# EAGLE schematic Schm1 (EAGLE 6.6.0)

## Sheet 1 of 3
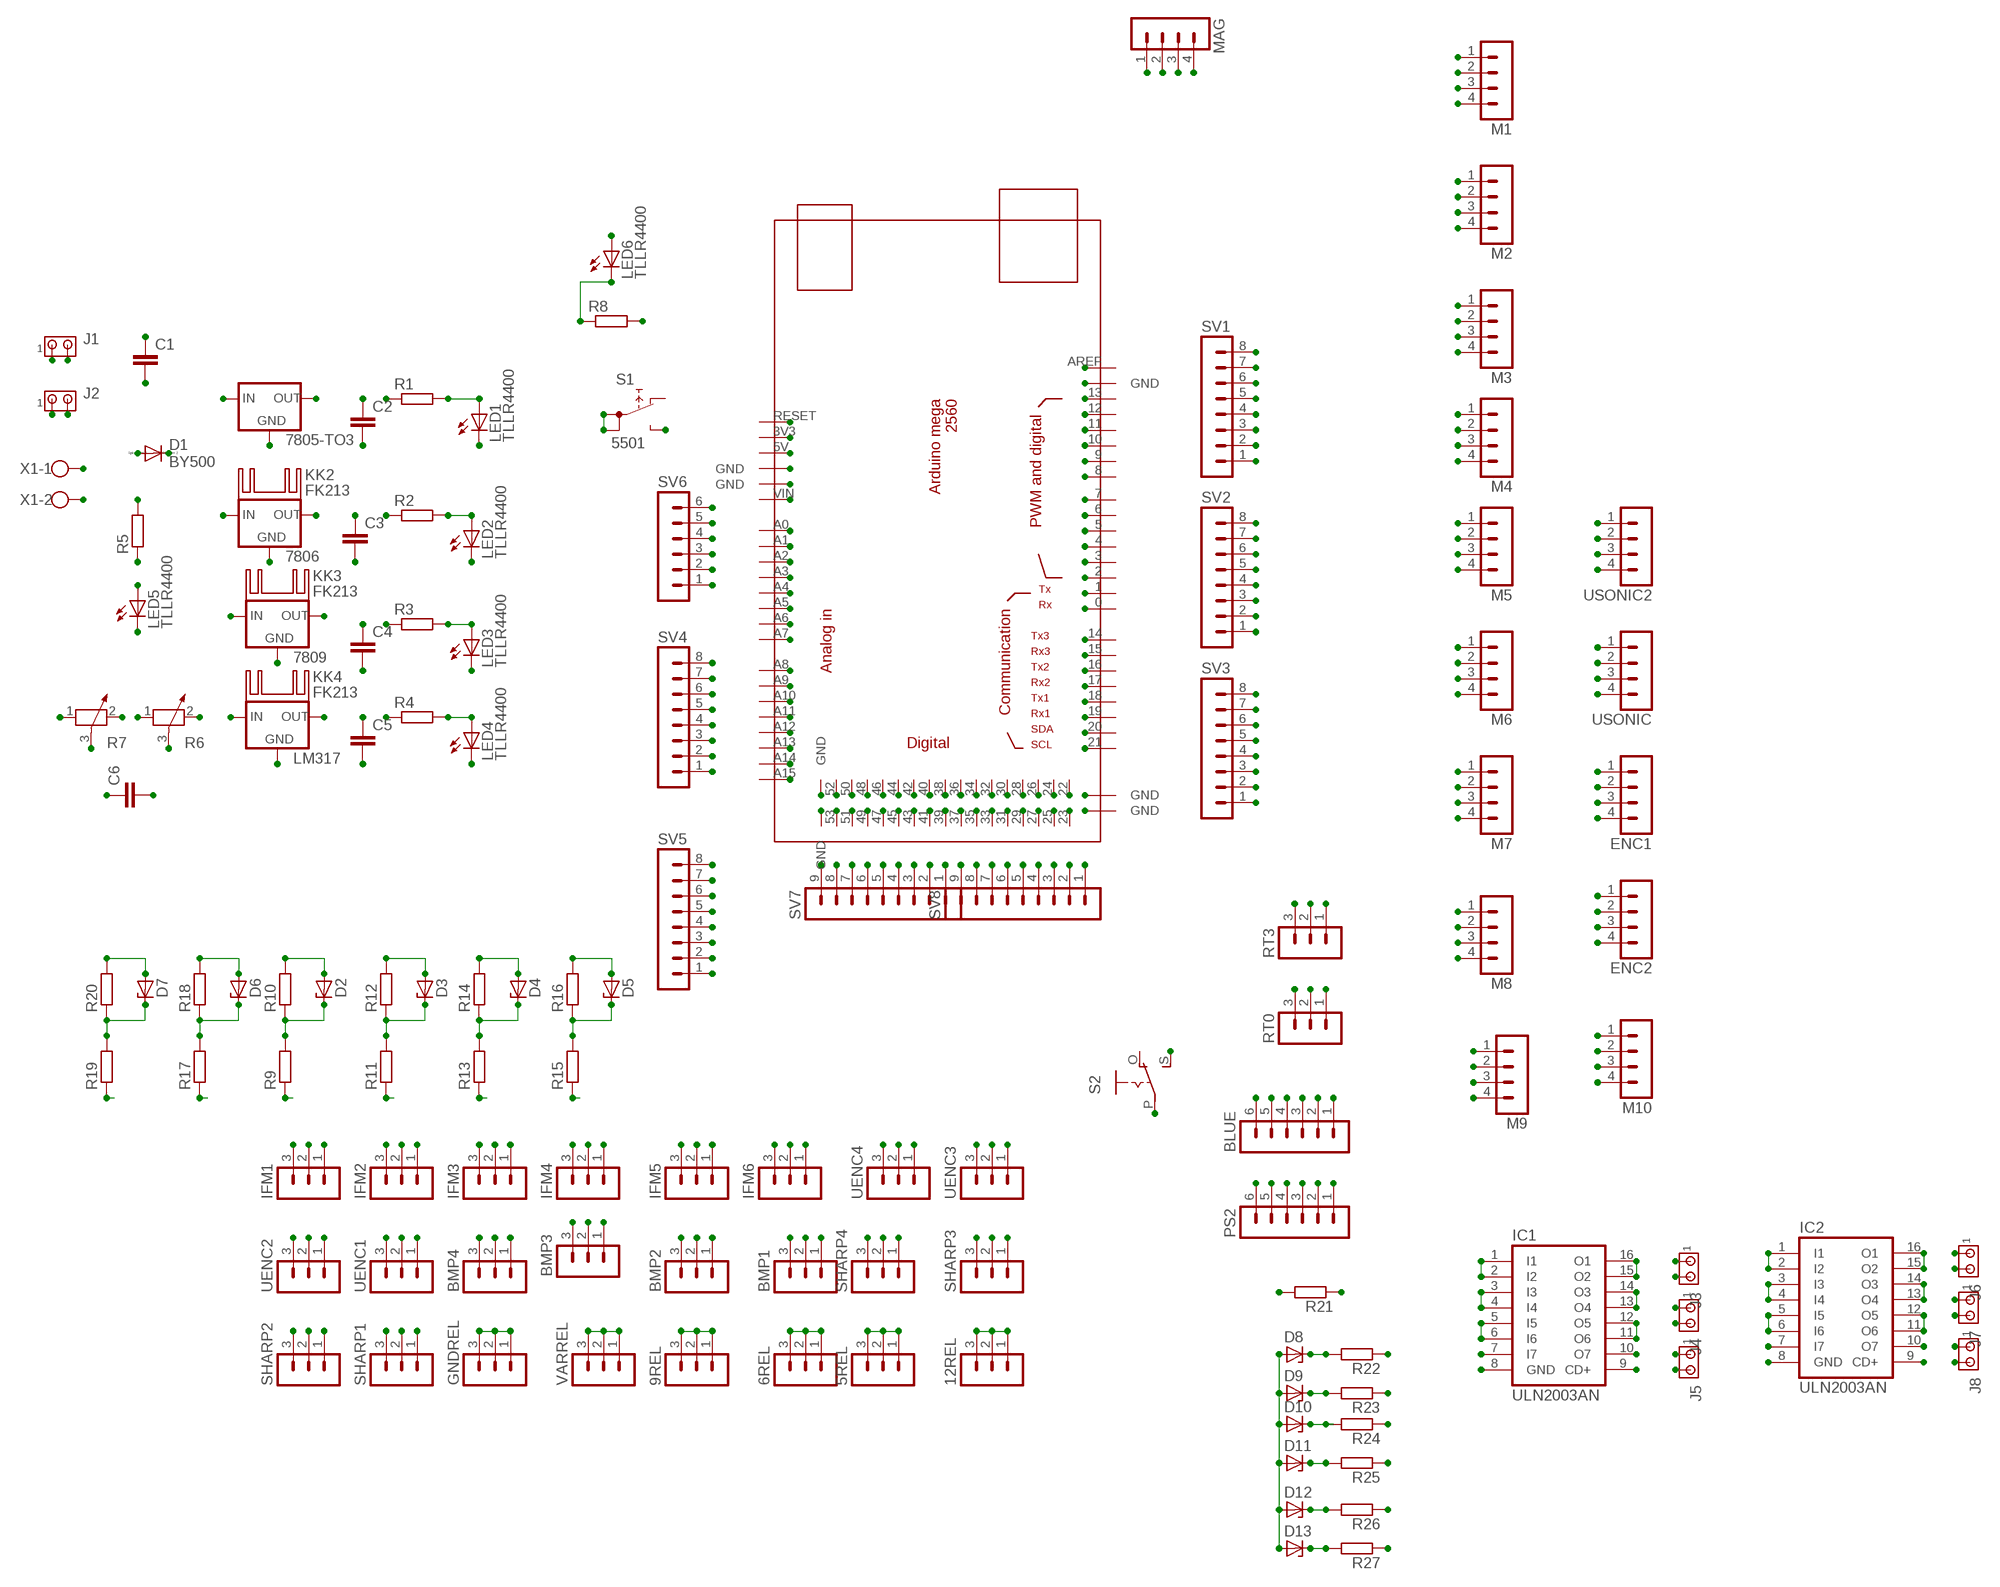
[diagram p0: schematic, sheet 1]

### Parts
5REL  MA03-1  [MA03-1]
6REL  MA03-1  [MA03-1]
9REL  MA03-1  [MA03-1]
12REL  MA03-1  [MA03-1]
7805-TO3  78XX-TO3  [TO3-78]
7806  78XXS  [78XXS]
7809  78XXS  [78XXS]
BLUE  MA06-1  [MA06-1]
BMP1  MA03-1  [MA03-1]
BMP2  MA03-1  [MA03-1]
BMP3  MA03-1  [MA03-1]
BMP4  MA03-1  [MA03-1]
C1  C-EU075-063X106  [C075-063X106]
C2  C-EU050-075X075  [C050-075X075]
C3  C-EU050-075X075  [C050-075X075]
C4  C-EU050-075X075  [C050-075X075]
C5  C-EU050-075X075  [C050-075X075]
C6  C-EU050-075X075  [C050-075X075]
D1  BY500  [DO201-15]
D2  ZENER-DIODEDO34-7  [DO34Z7]
D3  ZENER-DIODEDO34-7  [DO34Z7]
D4  ZENER-DIODEDO34-7  [DO34Z7]
D5  ZENER-DIODEDO34-7  [DO34Z7]
D6  ZENER-DIODEDO34-7  [DO34Z7]
D7  ZENER-DIODEDO34-7  [DO34Z7]
D8  ZENER-DIODEDO34-7  [DO34Z7]
D9  ZENER-DIODEDO34-7  [DO34Z7]
D10  ZENER-DIODEDO34-7  [DO34Z7]
D11  ZENER-DIODEDO34-7  [DO34Z7]
D12  ZENER-DIODEDO34-7  [DO34Z7]
D13  ZENER-DIODEDO34-7  [DO34Z7]
ENC1  MA04-1  [MA04-1]
ENC2  MA04-1  [MA04-1]
GNDREL  MA03-1  [MA03-1]
IC1  ULN2003AN  [DIL16]
IC2  ULN2003AN  [DIL16]
IFM1  MA03-1  [MA03-1]
IFM2  MA03-1  [MA03-1]
IFM3  MA03-1  [MA03-1]
IFM4  MA03-1  [MA03-1]
IFM5  MA03-1  [MA03-1]
IFM6  MA03-1  [MA03-1]
J1  MTA02-156  [1X2MTA]
J2  MTA02-156  [1X2MTA]
J3  MTA02-100  [10X02MTA]
J4  MTA02-100  [10X02MTA]
J5  MTA02-100  [10X02MTA]
J6  MTA02-100  [10X02MTA]
J7  MTA02-100  [10X02MTA]
J8  MTA02-100  [10X02MTA]
KK2  FK213  [FK213]
KK3  FK213  [FK213]
KK4  FK213  [FK213]
LED1  TLLR4400  [LED3MM]
LED2  TLLR4400  [LED3MM]
LED3  TLLR4400  [LED3MM]
LED4  TLLR4400  [LED3MM]
LED5  TLLR4400  [LED3MM]
LED6  TLLR4400  [LED3MM]
LM317  78XXS  [78XXS]
M1  MA04-1  [MA04-1]
M2  MA04-1  [MA04-1]
M3  MA04-1  [MA04-1]
M4  MA04-1  [MA04-1]
M5  MA04-1  [MA04-1]
M6  MA04-1  [MA04-1]
M7  MA04-1  [MA04-1]
M8  MA04-1  [MA04-1]
M9  MA04-1  [MA04-1]
M10  MA04-1  [MA04-1]
MAG  MA04-1  [MA04-1]
PS2  MA06-1  [MA06-1]
R1  R-EU_0207/10  [0207/10]
R2  R-EU_0207/10  [0207/10]
R3  R-EU_0207/10  [0207/10]
R4  R-EU_0207/10  [0207/10]
R5  R-EU_0207/10  [0207/10]
R6  POTENTIOMETER_PT-10  [PT-10]
R7  POTENTIOMETER_PT-10  [PT-10]
R8  R-EU_0207/10  [0207/10]
R9  R-EU_0207/10  [0207/10]
R10  R-EU_0207/10  [0207/10]
R11  R-EU_0207/10  [0207/10]
R12  R-EU_0207/10  [0207/10]
R13  R-EU_0207/10  [0207/10]
R14  R-EU_0207/10  [0207/10]
R15  R-EU_0207/10  [0207/10]
R16  R-EU_0207/10  [0207/10]
R17  R-EU_0207/10  [0207/10]
R18  R-EU_0207/10  [0207/10]
R19  R-EU_0207/10  [0207/10]
R20  R-EU_0207/10  [0207/10]
R21  R-EU_0207/10  [0207/10]
R22  R-EU_0207/10  [0207/10]
R23  R-EU_0207/10  [0207/10]
R24  R-EU_0207/10  [0207/10]
R25  R-EU_0207/10  [0207/10]
R26  R-EU_0207/10  [0207/10]
R27  R-EU_0207/10  [0207/10]
RT0  MA03-1  [MA03-1]
RT3  MA03-1  [MA03-1]
S1  5501  [5501]
S2  EG1218S  [EG1218]
SHARP1  MA03-1  [MA03-1]
SHARP2  MA03-1  [MA03-1]
SHARP3  MA03-1  [MA03-1]
SHARP4  MA03-1  [MA03-1]
SV1  MA08-1  [MA08-1]
SV2  MA08-1  [MA08-1]
SV3  MA08-1  [MA08-1]
SV4  MA08-1  [MA08-1]
SV5  MA08-1  [MA08-1]
SV6  MA06-1  [MA06-1]
SV7  MA09-1  [MA09-1]
SV8  MA09-1  [MA09-1]
U$1  MEGA_DEVICE  [MEGABOX]
UENC1  MA03-1  [MA03-1]
UENC2  MA03-1  [MA03-1]
UENC3  MA03-1  [MA03-1]
UENC4  MA03-1  [MA03-1]
USONIC  MA04-1  [MA04-1]
USONIC2  MA04-1  [MA04-1]
VARREL  MA03-1  [MA03-1]
X1  W237-102  [W237-102]

### Nets
0: RT0.2 SV2.1 U$1.0
1: RT0.3 SV2.2 U$1.1
2: ENC1.1 SV2.3 U$1.2 UENC1.3
3: ENC1.2 SV2.4 U$1.3 UENC2.3
3V3: MAG.2 SV6.5 U$1.3V3
4: M1.1 SV2.5 U$1.4
5: M6.1 SV2.6 U$1.5
5OUT: 5REL.1 5REL.2 5REL.3 7805-TO3.1(OUT) BLUE.3 BMP1.2 BMP2.2 BMP3.2 BMP4.2 C2.1 ENC1.3 ENC2.3 PS2.2 R1.1 R21.1 SHARP1.1 SHARP2.1 SHARP3.1 SHARP4.1 UENC1.2 UENC2.2 UENC3.2 UENC4.2 USONIC2.4 USONIC.4
6: M7.1 SV2.7 U$1.6
6OUT: 6REL.1 6REL.2 6REL.3 7806.OUT C3.1 R2.1
7: M8.1 SV2.8 U$1.7
8: M9.1 SV1.1 U$1.8
9: M10.1 SV1.2 U$1.9
10: M5.1 SV1.3 U$1.10
11: M4.1 SV1.4 U$1.11
12: M3.1 SV1.5 U$1.12
12IN: 7805-TO3.2(IN) 7806.IN 7809.IN C6.1 D1.C LM317.IN
12V: 12REL.1 12REL.2 12REL.3 C1.1 D1.A IC1.9(CD+) IC2.9(CD+) IFM1.2 IFM2.2 IFM3.2 IFM4.2 IFM5.2 IFM6.2 J1.1 J2.1 J3.1 J4.1 J5.1 J6.1 J7.1 J8.1 R5.2 X1.1
13: M2.1 SV1.6 U$1.13
14: RT3.3 SV3.8 U$1.14
15: RT3.2 SV3.7 U$1.15
16: BLUE.5 SV3.6 U$1.16
17: BLUE.4 SV3.5 U$1.17
18: ENC2.1 SV3.4 U$1.18 UENC3.3
19: ENC2.2 SV3.3 U$1.19 UENC4.3
20: MAG.3 SV3.2 U$1.20
21: MAG.4 SV3.1 U$1.21
22: M1.2 U$1.22
23: M1.3 SV8.2 U$1.23
24: M2.2 U$1.24
25: M6.2 SV8.3 U$1.25
26: M2.3 U$1.26
27: M6.3 SV8.4 U$1.27
28: M3.2 U$1.28
29: M7.2 SV8.5 U$1.29
30: M3.3 U$1.30
31: M7.3 SV8.6 U$1.31
32: M4.2 U$1.32
33: M8.2 SV8.7 U$1.33
34: M4.3 U$1.34
35: M8.3 SV8.8 U$1.35
36: M5.2 U$1.36
37: M9.2 SV8.9 U$1.37
38: M5.3 U$1.38
39: M9.3 SV7.1 U$1.39
40: BMP4.3 U$1.40
41: D11.C R25.2 SV7.2 U$1.41
42: BMP2.3 U$1.42
43: D12.C R26.2 SV7.3 U$1.43
44: BMP1.3 U$1.44
45: D13.C R27.2 SV7.4 U$1.45
46: BMP3.3 U$1.46
47: PS2.6 SV7.5 U$1.47
48: D10.C R24.2 U$1.48
49: PS2.5 SV7.6 U$1.49
50: D9.C R23.2 U$1.50
51: PS2.4 SV7.7 U$1.51
52: D8.C R22.2 U$1.52
53: PS2.3 R21.2 SV7.8 U$1.53
A0: M10.3 SV4.8 U$1.A0
A1: M10.2 SV4.7 U$1.A1
A2: SHARP1.3 SV4.6 U$1.A2
A3: SHARP2.3 SV4.5 U$1.A3
A4: SHARP3.3 SV4.4 U$1.A4
A5: SHARP4.3 SV4.3 U$1.A5
A6: SV4.2 U$1.A6 USONIC.3
A7: SV4.1 U$1.A7 USONIC.2
A8: SV5.8 U$1.A8 USONIC2.3
A9: SV5.7 U$1.A9 USONIC2.2
A10: D7.C R19.2 R20.1 SV5.6 U$1.A10
A11: D6.C R17.2 R18.1 SV5.5 U$1.A11
A12: D2.C R9.2 R10.1 SV5.4 U$1.A12
A13: D3.C R11.2 R12.1 SV5.3 U$1.A13
A14: D4.C R13.2 R14.1 SV5.2 U$1.A14
A15: D5.C R15.2 R16.1 SV5.1 U$1.A15
AREF: SV1.8 U$1.AREF
B3V3: BLUE.2 S2.P
DIN: LED5.A R5.1
GND: 7805-TO3.3(GND) 7806.GND 7809.GND BLUE.1 BMP1.1 BMP2.1 BMP3.1 BMP4.1 C1.2 C2.2 C3.2 C4.2 C5.2 C6.2 D2.A D3.A D4.A D5.A D6.A D7.A D8.A D9.A D10.A D11.A D12.A D13.A ENC1.4 ENC2.4 GNDREL.1 GNDREL.2 GNDREL.3 IC1.8(GND) IC2.8(GND) IFM1.1 IFM2.1 IFM3.1 IFM4.1 IFM5.1 IFM6.1 J1.2 J2.2 LED1.K(C) LED2.K(C) LED3.K(C) LED4.K(C) LED5.K(C) M1.4 M2.4 M3.4 M4.4 M5.4 M6.4 M7.4 M8.4 M9.4 M10.4 MAG.1 PS2.1 R7.3 R8.2 R10.2 R12.2 R14.2 R16.2 R18.2 R20.2 RT0.1 RT3.1 S1.NO SHARP1.2 SHARP2.2 SHARP3.2 SHARP4.2 SV1.7 SV6.2 SV6.3 SV7.9 U$1.GND@1(GND) U$1.GND@2(GND) U$1.GND@3(GND) U$1.GND@6(GND) U$1.GND@7(GND) UENC1.1 UENC2.1 UENC3.1 UENC4.1 USONIC2.1 USONIC.1 X1.2
JOK1: LM317.GND R6.3 R7.1
KEY: BLUE.6 S2.S
N$3: R7.2
N$4: LED6.K(C) R8.1
N$7: R6.2
N$10: IC1.7(I7)
N$13: LED4.A R4.2
N$16: LED3.A R3.2
N$17: LED2.A R2.2
N$20: LED1.A R1.2
N$22: IC1.10(O7)
N$25: IC2.7(I7)
N$38: IC2.10(O7)
PN1: IC1.15(O2) IC1.16(O1) J3.2
PN2: IC1.13(O4) IC1.14(O3) J4.2
PN3: IC1.11(O6) IC1.12(O5) J5.2
PN4: IC2.15(O2) IC2.16(O1) J6.2
PN5: IC2.13(O4) IC2.14(O3) J7.2
PN6: IC2.11(O6) IC2.12(O5) J8.2
RESET: S1.1A S1.1B SV6.6 U$1.RESET
S1: IFM1.3 R19.1
S2: IFM2.3 R17.1
S3: IFM3.3 R9.1
S4: IFM4.3 R11.1
S5: IFM5.3 R13.1
S6: IFM6.3 R15.1
U1: IC1.5(I5) IC1.6(I6) R22.1
U2: IC1.3(I3) IC1.4(I4) R23.1
U3: IC1.1(I1) IC1.2(I2) R24.1
U4: IC2.5(I5) IC2.6(I6) R25.1
U5: IC2.3(I3) IC2.4(I4) R26.1
U6: IC2.1(I1) IC2.2(I2) R27.1
VAROUT: C5.1 LM317.OUT R4.1 R6.1 VARREL.1 VARREL.2 VARREL.3
VCC: LED6.A SV6.4 SV8.1 U$1.5V U$1.GND@4(GND) U$1.GND@5(GND)
VIN: 9REL.1 9REL.2 9REL.3 7809.OUT C4.1 R3.1 SV6.1 U$1.VIN
Unconnected: S1.NC S2.O

## Sheet 2 of 3
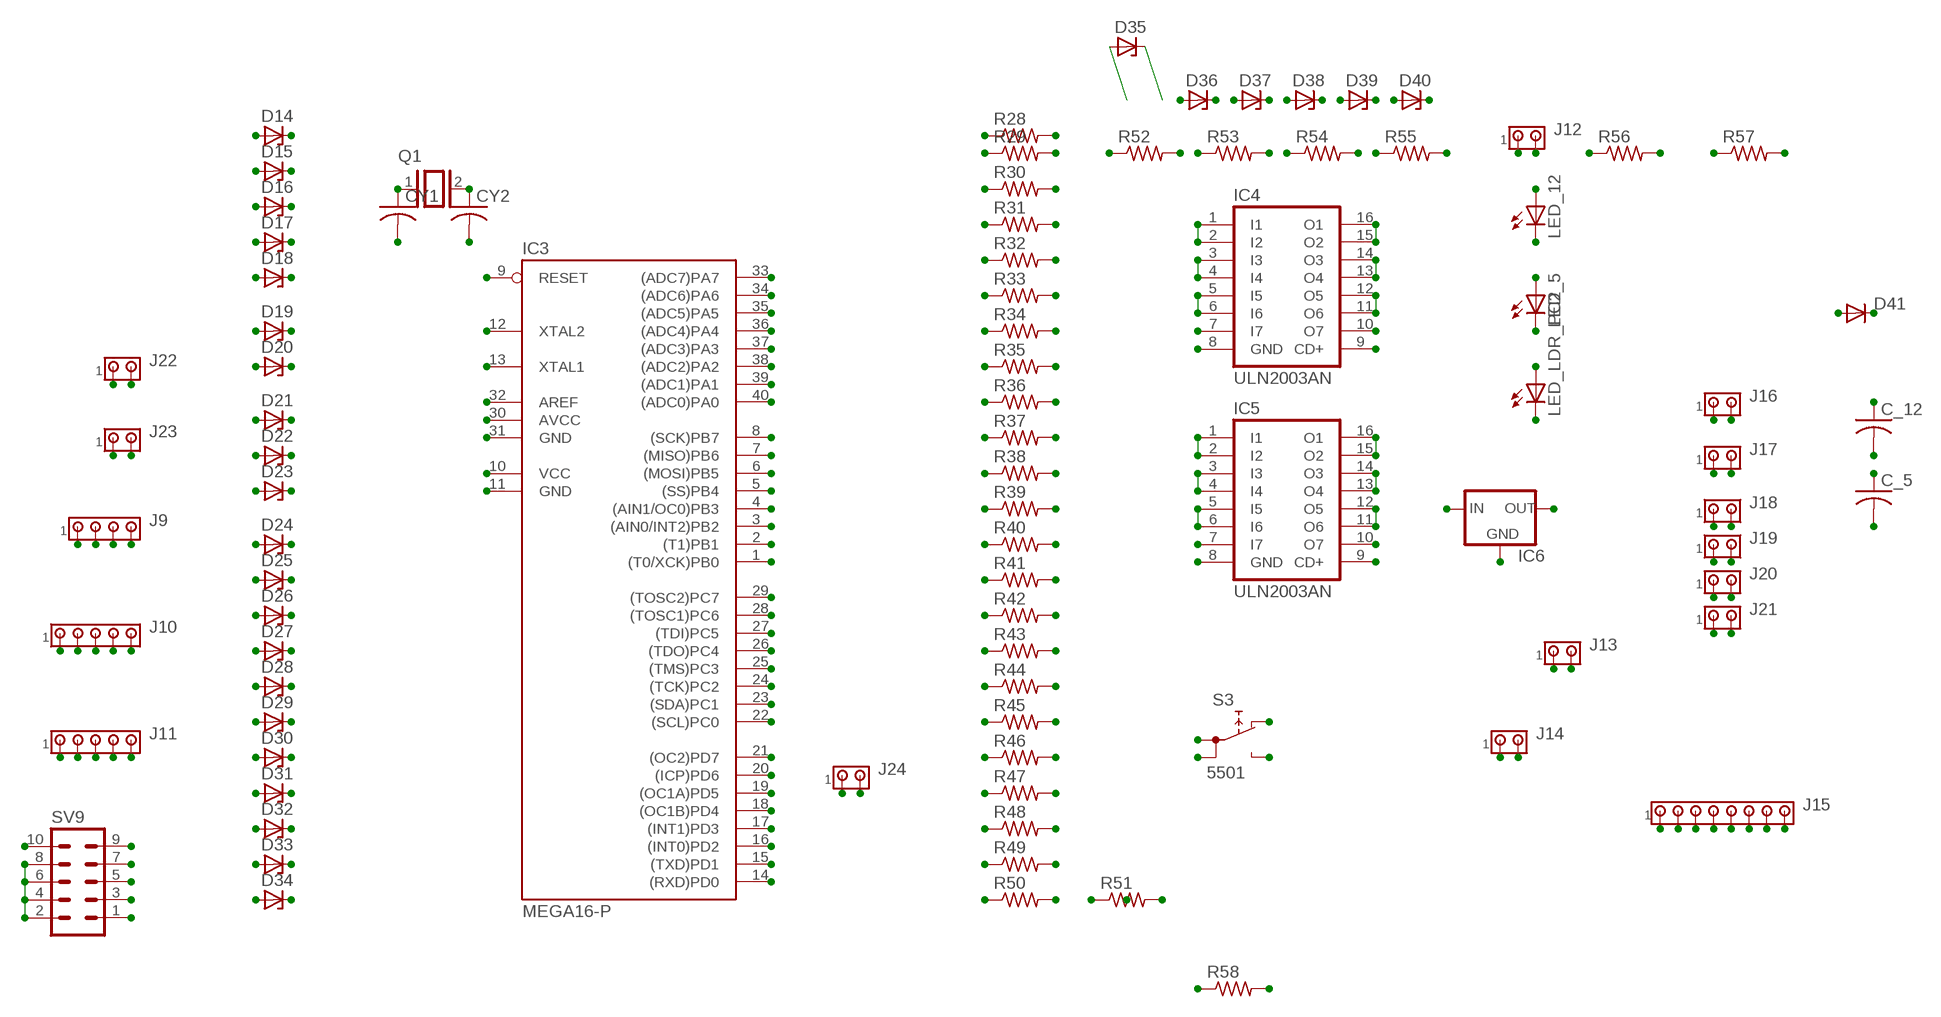
[diagram p1: schematic, sheet 2]

### Parts
C_5  C-US050-075X075  [C050-075X075]
C_12  C-US050-075X075  [C050-075X075]
CY1  C-US050-024X044  [C050-024X044]
CY2  C-US050-024X044  [C050-024X044]
D14  ZENER-DIODEDO34-7  [DO34Z7]
D15  ZENER-DIODEDO34-7  [DO34Z7]
D16  ZENER-DIODEDO34-7  [DO34Z7]
D17  ZENER-DIODEDO34-7  [DO34Z7]
D18  ZENER-DIODEDO34-7  [DO34Z7]
D19  ZENER-DIODEDO34-7  [DO34Z7]
D20  ZENER-DIODEDO34-7  [DO34Z7]
D21  ZENER-DIODEDO34-7  [DO34Z7]
D22  ZENER-DIODEDO34-7  [DO34Z7]
D23  ZENER-DIODEDO34-7  [DO34Z7]
D24  ZENER-DIODEDO34-7  [DO34Z7]
D25  ZENER-DIODEDO34-7  [DO34Z7]
D26  ZENER-DIODEDO34-7  [DO34Z7]
D27  ZENER-DIODEDO34-7  [DO34Z7]
D28  ZENER-DIODEDO34-7  [DO34Z7]
D29  ZENER-DIODEDO34-7  [DO34Z7]
D30  ZENER-DIODEDO34-7  [DO34Z7]
D31  ZENER-DIODEDO34-7  [DO34Z7]
D32  ZENER-DIODEDO34-7  [DO34Z7]
D33  ZENER-DIODEDO34-7  [DO34Z7]
D34  ZENER-DIODEDO34-7  [DO34Z7]
D35  ZENER-DIODEDO34-7  [DO34Z7]
D36  ZENER-DIODEDO34-7  [DO34Z7]
D37  ZENER-DIODEDO34-7  [DO34Z7]
D38  ZENER-DIODEDO34-7  [DO34Z7]
D39  ZENER-DIODEDO34-7  [DO34Z7]
D40  ZENER-DIODEDO34-7  [DO34Z7]
D41  DIODE-DO201-15  [DO201-15]
IC3  MEGA16-P  [DIL40]
IC4  ULN2003AN  [DIL16]
IC5  ULN2003AN  [DIL16]
IC6  78XX-TO3  [TO3-78]
J9  MTA04-100  [10X04MTA]
J10  MTA05-100  [10X05MTA]
J11  MTA05-100  [10X05MTA]
J12  MTA02-156  [1X2MTA]
J13  MTA02-156  [1X2MTA]
J14  MTA02-100  [10X02MTA]
J15  MTA08-100  [10X08MTA]
J16  MTA02-100  [10X02MTA]
J17  MTA02-100  [10X02MTA]
J18  MTA02-100  [10X02MTA]
J19  MTA02-100  [10X02MTA]
J20  MTA02-100  [10X02MTA]
J21  MTA02-100  [10X02MTA]
J22  MTA02-100  [10X02MTA]
J23  MTA02-156  [1X2MTA]
J24  MTA02-100  [10X02MTA]
LED_5  LED3MM  [LED3MM]
LED_12  LED3MM  [LED3MM]
LED_LDR_PC2  LED3MM  [LED3MM]
Q1  XTAL/S  [QS]
R28  R-US_0207/7  [0207/7]
R29  R-US_0207/7  [0207/7]
R30  R-US_0207/7  [0207/7]
R31  R-US_0207/7  [0207/7]
R32  R-US_0207/7  [0207/7]
R33  R-US_0207/7  [0207/7]
R34  R-US_0207/7  [0207/7]
R35  R-US_0207/7  [0207/7]
R36  R-US_0207/7  [0207/7]
R37  R-US_0207/7  [0207/7]
R38  R-US_0207/7  [0207/7]
R39  R-US_0207/7  [0207/7]
R40  R-US_0207/7  [0207/7]
R41  R-US_0207/7  [0207/7]
R42  R-US_0207/7  [0207/7]
R43  R-US_0207/7  [0207/7]
R44  R-US_0207/7  [0207/7]
R45  R-US_0207/7  [0207/7]
R46  R-US_0207/7  [0207/7]
R47  R-US_0207/7  [0207/7]
R48  R-US_0207/7  [0207/7]
R49  R-US_0207/7  [0207/7]
R50  R-US_0207/7  [0207/7]
R51  R-US_0207/7  [0207/7]
R52  R-US_0207/7  [0207/7]
R53  R-US_0207/7  [0207/7]
R54  R-US_0207/7  [0207/7]
R55  R-US_0207/7  [0207/7]
R56  R-US_0207/7  [0207/7]
R57  R-US_0207/7  [0207/7]
R58  R-US_0207/7  [0207/7]
S3  5501  [5501]
SV9  MA05-2  [MA05-2]

### Nets
12V1: C_12.1 D41.C IC4.9(CD+) IC5.9(CD+) IC6.2(IN) J12.1 J16.2 J17.2 J18.2 J19.2 J20.2 J21.2 J22.1 R28.2 R29.2 R30.2 R31.2 R32.2 R33.2 R34.2 R35.2 R36.2 R37.2 R38.2 R39.2 R40.2 R41.2 R42.2 R43.2 R44.2 R45.2 R46.2 R47.2 R48.2 R49.2
AREF1: IC3.32(AREF)
D: D41.A J23.1
GND1: C_5.2 C_12.2 CY1.2 CY2.2 D14.A D15.A D16.A D17.A D18.A D19.A D20.A D21.A D22.A D23.A D24.A D25.A D26.A D27.A D28.A D29.A D30.A D31.A D32.A D33.A D34.A D35.A D36.A D37.A D38.A D39.A D40.A IC3.11(GND) IC3.31(GND) IC4.8(GND) IC5.8(GND) IC6.3(GND) J9.4 J12.2 J13.2 J14.2 J22.2 J23.2 LED_5.K(C) LED_12.K(C) LED_LDR_PC2.K(C) S3.NO SV9.2 SV9.4 SV9.6 SV9.8
LED1: LED_12.A R49.1
LED2: LED_5.A R50.1
LED3: LED_LDR_PC2.A R51.2
N1: IC4.15(O2) IC4.16(O1) J16.1
N2: IC4.13(O4) IC4.14(O3) J17.1
N3: IC4.11(O6) IC4.12(O5) J18.1
N4: IC5.15(O2) IC5.16(O1) J19.1
N5: IC5.13(O4) IC5.14(O3) J20.1
N6: IC5.11(O6) IC5.12(O5) J21.1
N$29: SV9.7
N$30: S3.NC
N$162: IC4.7(I7)
N$170: IC4.10(O7)
N$178: IC5.10(O7)
N$186: IC5.7(I7)
PA0: D34.C IC3.40((ADC0)PA0) J15.1 R48.1
PA1: D33.C IC3.39((ADC1)PA1) J15.2 R47.1
PA2: D32.C IC3.38((ADC2)PA2) J15.3 R46.1
PA3: D31.C IC3.37((ADC3)PA3) J15.4 R45.1
PA4: D30.C IC3.36((ADC4)PA4) J15.5 R44.1
PA5: D29.C IC3.35((ADC5)PA5) J15.6 R43.1
PA6: D28.C IC3.34((ADC6)PA6) J15.7 R42.1
PA7: D27.C IC3.33((ADC7)PA7) J15.8 R41.1
PB0: D14.C IC3.1((T0/XCK)PB0) J10.1 R28.1
PB1: D15.C IC3.2((T1)PB1) J10.2 R29.1
PB2: D16.C IC3.3((AIN0/INT2)PB2) J10.3 R30.1
PB3: D17.C IC3.4((AIN1/OC0)PB3) J10.4 R31.1
PB4: D18.C IC3.5((SS)PB4) J10.5 R32.1
PB5: IC3.6((MOSI)PB5) SV9.9
PB6: IC3.7((MISO)PB6) SV9.1
PB7: IC3.8((SCK)PB7) SV9.3
PC0: D25.C IC3.22((SCL)PC0) J9.2 R39.1
PC1: D26.C IC3.23((SDA)PC1) J9.1 R40.1
PC2: D40.C IC3.24((TCK)PC2) R51.1 R57.1
PC3: D39.C IC3.25((TMS)PC3) R56.1
PC4: D38.C IC3.26((TDO)PC4) R55.1
PC5: D37.C IC3.27((TDI)PC5) R54.1
PC6: D36.C IC3.28((TOSC1)PC6) R53.1
PC7: D35.C IC3.29((TOSC2)PC7) R52.1
PD0: IC3.14((RXD)PD0) J24.1
PD1: IC3.15((TXD)PD1) J24.2
PD2: D19.C IC3.16((INT0)PD2) J11.1 R33.1
PD3: D20.C IC3.17((INT1)PD3) J11.2 R34.1
PD4: D21.C IC3.18((OC1B)PD4) J11.3 R35.1
PD5: D22.C IC3.19((OC1A)PD5) J11.4 R36.1
PD6: D23.C IC3.20((ICP)PD6) J11.5 R37.1
PD7: D24.C IC3.21((OC2)PD7) J9.3 R38.1
RESET1: IC3.9(RESET) R58.2 S3.1A S3.1B SV9.5
U7: IC4.1(I1) IC4.2(I2) R52.2
U8: IC4.3(I3) IC4.4(I4) R53.2
U9: IC4.5(I5) IC4.6(I6) R54.2
U10: IC5.1(I1) IC5.2(I2) R55.2
U11: IC5.3(I3) IC5.4(I4) R56.2
U12: IC5.5(I5) IC5.6(I6) R57.2
VCC1: C_5.1 IC3.10(VCC) IC3.30(AVCC) IC6.1(OUT) J13.1 J14.1 R50.2 R58.1 SV9.10
XTAL1: CY1.1 IC3.13(XTAL1) Q1.1
XTAL2: CY2.1 IC3.12(XTAL2) Q1.2

## Sheet 3 of 3
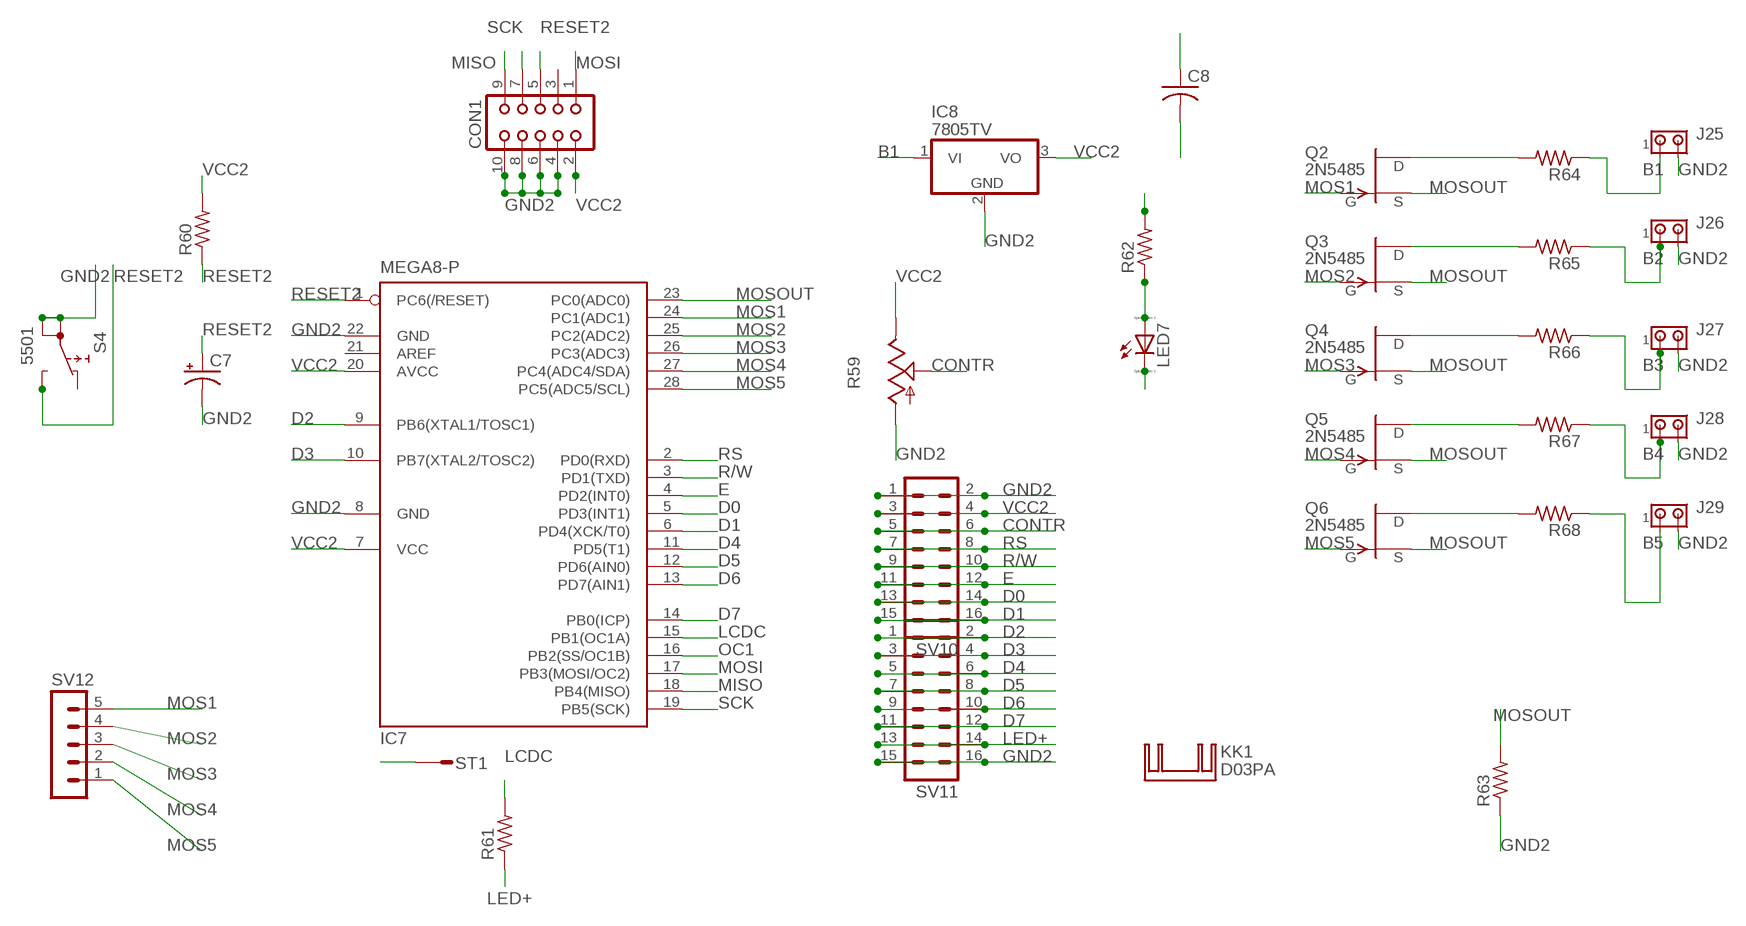
[diagram p2: schematic, sheet 3]

### Parts
C7  CPOL-USE2.5-7  [E2,5-7]
C8  C-US075-042X103  [C075-042X103]
CON1  CON10  [CON10]
IC7  MEGA8-P  [DIL28-3]
IC8  7805TV  [TO220V]
J25  MTA02-156  [1X2MTA]
J26  MTA02-156  [1X2MTA]
J27  MTA02-156  [1X2MTA]
J28  MTA02-156  [1X2MTA]
J29  MTA02-156  [1X2MTA]
KK1  D03PA  [D03PA]
LED7  LED_ELD260  [LED_LD260]
Q2  2N5485  [TO92-]
Q3  2N5485  [TO92-]
Q4  2N5485  [TO92-]
Q5  2N5485  [TO92-]
Q6  2N5485  [TO92-]
R59  TRIM_US-CA9V  [CA9V]
R60  R-US_0207/10  [0207/10]
R61  R-US_0207/10  [0207/10]
R62  R-US_0207/10  [0207/10]
R63  R-US_0207/10  [0207/10]
R64  R-US_0207/10  [0207/10]
R65  R-US_0207/10  [0207/10]
R66  R-US_0207/10  [0207/10]
R67  R-US_0207/10  [0207/10]
R68  R-US_0207/10  [0207/10]
S4  5501  [5501]
ST1  ST2,8  [ST2,8]
SV10  MA08-2  [MA08-2]
SV11  MA08-2  [MA08-2]
SV12  MA05-1  [MA05-1]

### Nets
B1: IC8.1(VI) J25.1 R64.1
B2: J26.1 R65.1
B3: J27.1 R66.1
B4: J28.1 R67.1
B5: J29.1 R68.1
CONTR: R59.S SV10.5 SV10.6
D0: IC7.5(PD3(INT1)) SV10.13 SV10.14
D1: IC7.6(PD4(XCK/T0)) SV10.15 SV10.16
D2: IC7.9(PB6(XTAL1/TOSC1)) SV11.1 SV11.2
D3: IC7.10(PB7(XTAL2/TOSC2)) SV11.3 SV11.4
D4: IC7.11(PD5(T1)) SV11.5 SV11.6
D5: IC7.12(PD6(AIN0)) SV11.7 SV11.8
D6: IC7.13(PD7(AIN1)) SV11.9 SV11.10
D7: IC7.14(PB0(ICP)) SV11.11 SV11.12
E: IC7.4(PD2(INT0)) SV10.11 SV10.12
GND2: C7.- C8.2 CON1.4 CON1.6 CON1.8 CON1.10 IC7.8(GND) IC7.22(GND) IC8.2(GND) J25.2 J26.2 J27.2 J28.2 J29.2 LED7.K(C) R59.A R63.1 S4.1A S4.1B SV10.1 SV10.2 SV11.15 SV11.16
LCDC: IC7.15(PB1(OC1A)) R61.2
LED+: R61.1 SV11.13 SV11.14
MISO: CON1.9 IC7.18(PB4(MISO))
MOS1: IC7.24(PC1(ADC1)) Q2.1(G) SV12.5
MOS2: IC7.25(PC2(ADC2)) Q3.1(G) SV12.4
MOS3: IC7.26(PC3(ADC3)) Q4.1(G) SV12.3
MOS4: IC7.27(PC4(ADC4/SDA)) Q5.1(G) SV12.2
MOS5: IC7.28(PC5(ADC5/SCL)) Q6.1(G) SV12.1
MOSI: CON1.1 IC7.17(PB3(MOSI/OC2))
MOSOUT: IC7.23(PC0(ADC0)) Q2.2(S) Q3.2(S) Q4.2(S) Q5.2(S) Q6.2(S) R63.2
N$1: Q4.3(D) R66.2
N$2: LED7.A R62.1
N$8: Q2.3(D) R64.2
N$9: Q3.3(D) R65.2
N$11: Q5.3(D) R67.2
N$12: Q6.3(D) R68.2
OC1: IC7.16(PB2(SS/OC1B)) ST1.1(ST)
R/W: IC7.3(PD1(TXD)) SV10.9 SV10.10
RESET2: C7.+ CON1.5 IC7.1(PC6(/RESET)) R60.1 S4.NO
RS: IC7.2(PD0(RXD)) SV10.7 SV10.8
SCK: CON1.7 IC7.19(PB5(SCK))
VCC2: C8.1 CON1.2 IC7.7(VCC) IC7.20(AVCC) IC8.3(VO) R59.E R60.2 R62.2 SV10.3 SV10.4
Unconnected: CON1.3 IC7.21(AREF) S4.NC

## Library data of the parts
5REL 6REL 9REL 12REL BMP1-BMP4 GNDREL IFM1-IFM6 RT0 RT3 SHARP1-SHARP4 UENC1-UENC4 VARREL = con-lstb:MA03-1: PIN HEADER; OC_FARNELL: unknown; OC_NEWARK: unknown
7805-TO3 IC6 = v-reg:78XX-TO3: VOLTAGE REGULATOR
7806 7809 LM317 = v-reg:78XXS: VOLTAGE REGULATOR
BLUE PS2 SV6 = con-lstb:MA06-1: PIN HEADER; OC_FARNELL: unknown; OC_NEWARK: unknown
C1-C6 = rcl:C-EU: CAPACITOR, European symbol
C7 = rcl:CPOL-US: POLARIZED CAPACITOR, American symbol
C8 C_5 C_12 CY1 CY2 = rcl:C-US: CAPACITOR, American symbol
CON1 = con-harting:CON10: CONNECTOR; OC_FARNELL: unknown; OC_NEWARK: unknown
D1 = diode:BY500: DIODE fast recovery diode, 5 A, 800 V
D2-D40 = diode:ZENER-DIODE: Z-Diode
D41 = diode:DIODE-: DIODE
ENC1 ENC2 M1-M10 MAG USONIC USONIC2 = con-lstb:MA04-1: PIN HEADER; OC_FARNELL: unknown; OC_NEWARK: unknown
IC1 IC2 IC4 IC5 = uln-udn:ULN2003A: DRIVER ARRAY
IC3 = atmel:MEGA16-P: MICROCONTROLLER 16 Kbytes FLASH 1 kbytes SRAM 512 bytes EEPROM USART 8-channel 10 bit ADC Source: avr.lbr; MPN: ATMEGA16-16PU; OC_FARNELL: 9171142; OC_NEWARK: 01M6885
IC7 = atmel:MEGA8-P: MICROCONTROLLER 8 Kbytes FLASH, 1 kbytes SRAM, 512 bytes EEPROM, USART, 4-channel 10 bit ADC, 2-channel 8 bit ADC Pin compatible with Atmega48, ATMega88, ATMega168 Source: avr.lbr; OC_FARNELL: unknown; OC_NEWARK: unknown
IC8 = linear:78*: Positive VOLTAGE REGULATOR Source: http://cache.national.com/ds/LM/LM78L05.pdf http://www.fairchildsemi.com/ds/LM/LM7805.pdf
J1 J2 J12 J13 J23 J25-J29 = con-amp:MTA02-156: AMP connector
J3-J8 J14 J16-J22 J24 = con-amp:MTA02-100: AMP connector
J9 = con-amp:MTA04-100: AMP connector
J10 J11 = con-amp:MTA05-100: AMP connector
J15 = con-amp:MTA08-100: AMP connector
KK1 = heatsink:D03PA: HEATSINK distributor Schukat
KK2-KK4 = heatsink:FK213: HEATSINK manufacturer Fischer/distributor Buerklin
LED1-LED6 = led:TLLR4400: Low Current (2mA) LED 3 mm Tinted Diffused Package color RED Source: Data sheet <http://www.farnell.com/datasheets/391100.pdf>; MF: VISHAY SEMICONDUCTOR; OC_FARNELL: 1612437
LED7 = eagle-ltspice:LED_E: LED Source: http://www.osram.convergy.de Source: www.luxeon.com Source: www.kingbright.com; SPICEMODEL: NONE; SPICEPREFIX: D; SPICETYPE: diode
LED_5 LED_12 LED_LDR_PC2 = led:LED: LED OSRAM: - CHIPLED LG R971, LG N971, LY N971, LG Q971, LY Q971, LO R971, LY R971 LH N974, LH R974 LS Q976, LO Q976, LY Q976 LO Q996 - Hyper CHIPLED LW Q18S LB Q993, LB Q99A, LB R99A - SideLED LS A670, LO A670, LY A670, LG A670, LP A670 LB A673, LV A673, LT A673, LW A673 LH A674 LY A675 LS A676, LA A676, LO A676, LY A676, LW A676 LS A679, LY A679, LG A679 - Hyper Micro SIDELED® LS Y876, LA Y876, LO Y876, LY Y876 LT Y87S - SmartLED LW L88C, LW L88S LB L89C, LB L89S, LG L890 LS L89K, LO L89K, LY L89K LS L896, LA L896, LO L896, LY L896 - TOPLED LS T670, LO T670, LY T670, LG T670, LP T670 LSG T670, LSP T670, LSY T670, LOP T670, LYG T670 LG T671, LOG T671, LSG T671 LB T673, LV T673, LT T673, LW T673 LH T674 LS T676, LA T676, LO T676, LY T676, LB T676, LH T676, LSB T676, LW T676 LB T67C, LV T67C, LT T67C, LS T67K, LO T67K, LY T67K, LW E67C LS E67B, LA E67B, LO E67B, LY E67B, LB E67C, LV E67C, LT E67C LW T67C LS T679, LY T679, LG T679 LS T770, LO T770, LY T770, LG T770, LP T770 LB T773, LV T773, LT T773, LW T773 LH T774 LS E675, LA E675, LY E675, LS T675 LS T776, LA T776, LO T776, LY T776, LB T776 LHGB T686 LT T68C, LB T68C - Hyper Mini TOPLED® LB M676 - Mini TOPLED Santana® LG M470 LS M47K, LO M47K, LY M47K Source: http://www.osram.convergy.de LUXEON: - LUMILED® LXK2-PW12-R00, LXK2-PW12-S00, LXK2-PW14-U00, LXK2-PW14-V00 LXK2-PM12-R00, LXK2-PM12-S00, LXK2-PM14-U00 LXK2-PE12-Q00, LXK2-PE12-R00, LXK2-PE12-S00, LXK2-PE14-T00, LXK2-PE14-U00 LXK2-PB12-K00, LXK2-PB12-L00, LXK2-PB12-M00, LXK2-PB14-N00, LXK2-PB14-P00, LXK2-PB14-Q00 LXK2-PR12-L00, LXK2-PR12-M00, LXK2-PR14-Q00, LXK2-PR14-R00 LXK2-PD12-Q00, LXK2-PD12-R00, LXK2-PD12-S00 LXK2-PH12-R00, LXK2-PH12-S00 LXK2-PL12-P00, LXK2-PL12-Q00, LXK2-PL12-R00 Source: www.luxeon.com KINGBRIGHT: KA-3528ASYC Source: www.kingbright.com
Q1 = special:XTAL/S: CRYSTAL
Q2-Q6 = transistor-fet:?548*: N-Channel JFETs Source: VISHAY 2N5484.pdf Compatible: TO92 2N5245 J304 J305 U310 J308 J309 J310 TO72 2N4416 2N4416A 2N3823 2N4351 3N169 3N170 3N171 MFE3002 TO18 2N3796 2N3797 MFE825 Source: Motorola European Master Guide Pacge 3-59
R1-R5 R8-R27 = rcl:R-EU_: RESISTOR, European symbol
R6 R7 = rcl:POTENTIOMETER_: Potentiometer
R28-R58 R60-R68 = rcl:R-US_: RESISTOR, American symbol
R59 = pot:TRIM_US-: POTENTIOMETER
S1 S3 S4 = switch:55?: PUSHBUTTON SERIES 5500 SWITCHES Source: www.e-switch.com .. 5500.pdf
S2 = adafruit:EG1218: SLIDING SWITCH 0.1" spacing through hole, vertical SPDT slide switch http://www.ladyada.net/library/pcb/eaglelibrary.html
ST1 = con-rib:ST2,8: RIBBON CABLE CONNECTOR Flachstecker / Faston; OC_FARNELL: unknown; OC_NEWARK: unknown
SV1-SV5 = con-lstb:MA08-1: PIN HEADER; OC_FARNELL: unknown; OC_NEWARK: unknown
SV7 SV8 = con-lstb:MA09-1: PIN HEADER; OC_FARNELL: unknown; OC_NEWARK: unknown
SV9 = con-lstb:MA05-2: PIN HEADER; OC_FARNELL: unknown; OC_NEWARK: unknown
SV10 SV11 = con-lstb:MA08-2: PIN HEADER; OC_FARNELL: unknown; OC_NEWARK: unknown
SV12 = con-lstb:MA05-1: PIN HEADER; OC_FARNELL: unknown; OC_NEWARK: unknown
U$1 = ArduinoMegaSymbol:MEGA_DEVICE: mega card as device
X1 = con-wago-500:W237-102: WAGO SCREW CLAMP; MPN: 237-102; OC_FARNELL: unknown; OC_NEWARK: 70K9898

## Net classes
0 default: width 1.016 mm, drill 0.61 mm, clearance 0.61 mm